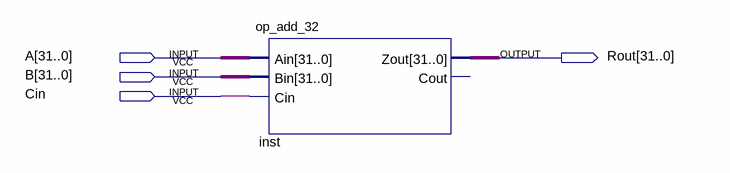
[diagram p0: schematic sheet]
// Quartus schematic SimpleRISCComputer.bdf as structural Verilog: 1 symbols, 4 pins
module SimpleRISCComputer (
  input  [31:0] A,
  input  [31:0] B,
  input  Cin,
  output [31:0] Rout
);

  op_add_32 inst (.Ain(A), .Bin(B), .Cin(Cin), .Zout(Rout));  // open: Cout
endmodule
